# Altium schematic sheet Pedal_Display.SchDoc
size A4; SheetNumber: 1; SheetTotal: 1
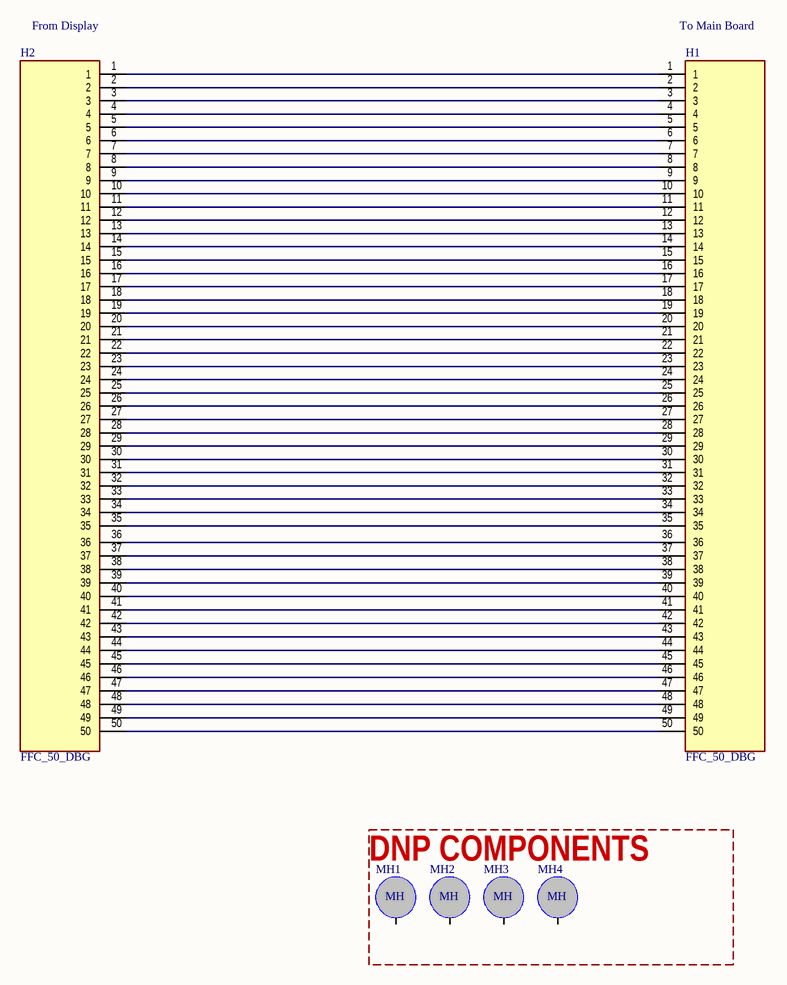
[diagram p0: Pedal_Display.SchDoc]

## Parts
H1  FFC_50_DBG  [FFC_50_DBG]
H2  FFC_50_DBG  [FFC_50_DBG]
MH1  MountingHole  [Hole_3mm]  (value not drawn)
MH2  MountingHole  [Hole_3mm]  (value not drawn)
MH3  MountingHole  [Hole_3mm]  (value not drawn)
MH4  MountingHole  [Hole_3mm]  (value not drawn)

## Blocks framed on the sheet
DNP COMPONENTS: MH1-MH4

## Nets
NetH1_1: H1.1 H2.1
NetH1_2: H1.2 H2.2
NetH1_3: H1.3 H2.3
NetH1_4: H1.4 H2.4
NetH1_5: H1.5 H2.5
NetH1_6: H1.6 H2.6
NetH1_7: H1.7 H2.7
NetH1_8: H1.8 H2.8
NetH1_9: H1.9 H2.9
NetH1_10: H1.10 H2.10
NetH1_11: H1.11 H2.11
NetH1_12: H1.12 H2.12
NetH1_13: H1.13 H2.13
NetH1_14: H1.14 H2.14
NetH1_15: H1.15 H2.15
NetH1_16: H1.16 H2.16
NetH1_17: H1.17 H2.17
NetH1_18: H1.18 H2.18
NetH1_19: H1.19 H2.19
NetH1_20: H1.20 H2.20
NetH1_21: H1.21 H2.21
NetH1_22: H1.22 H2.22
NetH1_23: H1.23 H2.23
NetH1_24: H1.24 H2.24
NetH1_25: H1.25 H2.25
NetH1_26: H1.26 H2.26
NetH1_27: H1.27 H2.27
NetH1_28: H1.28 H2.28
NetH1_29: H1.29 H2.29
NetH1_30: H1.30 H2.30
NetH1_31: H1.31 H2.31
NetH1_32: H1.32 H2.32
NetH1_33: H1.33 H2.33
NetH1_34: H1.34 H2.34
NetH1_35: H1.35 H2.35
NetH1_36: H1.36 H2.36
NetH1_37: H1.37 H2.37
NetH1_38: H1.38 H2.38
NetH1_39: H1.39 H2.39
NetH1_40: H1.40 H2.40
NetH1_41: H1.41 H2.41
NetH1_42: H1.42 H2.42
NetH1_43: H1.43 H2.43
NetH1_44: H1.44 H2.44
NetH1_45: H1.45 H2.45
NetH1_46: H1.46 H2.46
NetH1_47: H1.47 H2.47
NetH1_48: H1.48 H2.48
NetH1_49: H1.49 H2.49
NetH1_50: H1.50 H2.50

Not connected (* = marked no-connect by the designer): MH1 0; MH2 0; MH3 0; MH4 0

## Notes on the sheet
- (near H2) From Display
- (near H1) To Main Board
- (in symbol MountingHole) MH

## Library data of the parts
H1 = FFC_50_DBG: System: Connector